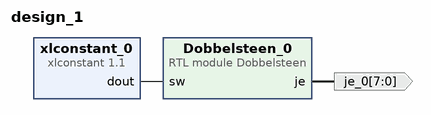
[diagram p0: block diagram of the top level]
# Vivado block design design_1, xc7z007sclg225-1, Vivado 2018.2
create_bd_design design_1

create_bd_port -dir O -from 7 -to 0 je_0

create_bd_cell -type ip -vlnv xilinx.com:ip:xlconstant:1.1 xlconstant_0
set_property -dict {CONFIG.CONST_WIDTH 4 CONFIG.CONST_VAL 5} [get_bd_cells xlconstant_0]
create_bd_cell -type module -reference Dobbelsteen Dobbelsteen_0

# ---- connections ----

connect_bd_net [get_bd_pins Dobbelsteen_0/je] [get_bd_ports je_0]
connect_bd_net [get_bd_pins xlconstant_0/dout] [get_bd_pins Dobbelsteen_0/sw]

validate_bd_design
save_bd_design
